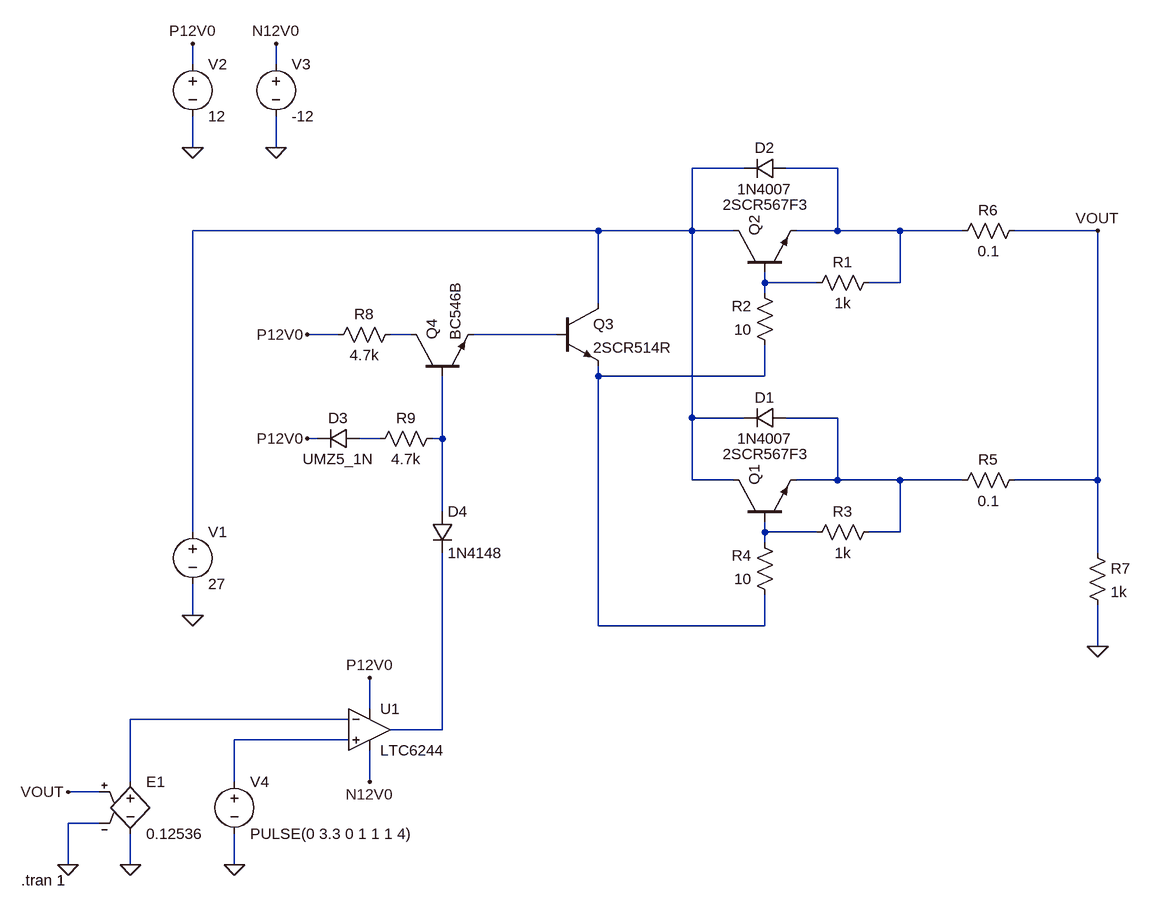
[diagram p0: schematic PowerBoard_PowerSection.asc]
PowerBoard_PowerSection.asc, the LTspice schematic file:
Version 4.1
SHEET 1 1464 728
WIRE 16 -544 16 -576
WIRE 144 -544 144 -576
WIRE 16 -416 16 -464
WIRE 144 -416 144 -464
WIRE 864 -384 784 -384
WIRE 1008 -384 928 -384
WIRE 640 -288 16 -288
WIRE 784 -288 784 -384
WIRE 784 -288 640 -288
WIRE 848 -288 784 -288
WIRE 1008 -288 1008 -384
WIRE 1008 -288 944 -288
WIRE 1104 -288 1008 -288
WIRE 1200 -288 1104 -288
WIRE 1408 -288 1280 -288
WIRE 896 -208 896 -224
WIRE 976 -208 896 -208
WIRE 1104 -208 1104 -288
WIRE 1104 -208 1056 -208
WIRE 896 -192 896 -208
WIRE 640 -176 640 -288
WIRE 240 -128 192 -128
WIRE 352 -128 320 -128
WIRE 576 -128 448 -128
WIRE 640 -64 640 -80
WIRE 896 -64 896 -112
WIRE 896 -64 640 -64
WIRE 784 0 784 -288
WIRE 864 0 784 0
WIRE 1008 0 928 0
WIRE 208 32 192 32
WIRE 304 32 272 32
WIRE 400 32 400 -64
WIRE 400 32 384 32
WIRE 784 96 784 0
WIRE 848 96 784 96
WIRE 1008 96 1008 0
WIRE 1008 96 944 96
WIRE 1104 96 1008 96
WIRE 1200 96 1104 96
WIRE 1408 96 1408 -288
WIRE 1408 96 1280 96
WIRE 400 144 400 32
WIRE 16 176 16 -288
WIRE 896 176 896 160
WIRE 976 176 896 176
WIRE 1104 176 1104 96
WIRE 1104 176 1056 176
WIRE 896 192 896 176
WIRE 1408 208 1408 96
WIRE 16 304 16 256
WIRE 640 320 640 -64
WIRE 896 320 896 272
WIRE 896 320 640 320
WIRE 1408 352 1408 288
WIRE 288 448 288 400
WIRE 256 464 -80 464
WIRE 400 480 400 208
WIRE 400 480 320 480
WIRE 256 496 80 496
WIRE -80 560 -80 464
WIRE 80 560 80 496
WIRE 288 560 288 512
WIRE -128 576 -176 576
WIRE -128 624 -176 624
WIRE -176 688 -176 624
WIRE -80 688 -80 640
WIRE 80 688 80 640
FLAG 16 304 0
FLAG 1408 352 0
FLAG 16 -416 0
FLAG 16 -576 P12V0
FLAG 144 -416 0
FLAG 144 -576 N12V0
FLAG 192 -128 P12V0
FLAG 192 32 P12V0
FLAG 288 400 P12V0
FLAG 288 560 N12V0
FLAG 80 688 0
FLAG -80 688 0
FLAG -176 688 0
FLAG -176 576 VOUT
FLAG 1408 -288 VOUT
SYMBOL voltage 16 160 R0
WINDOW 123 0 0 Left 0
WINDOW 39 0 0 Left 0
SYMATTR InstName V1
SYMATTR Value 27
SYMBOL npn 848 160 R270
WINDOW 3 104 -17 VRight 2
SYMATTR InstName Q1
SYMATTR Value 2SCR567F3
SYMBOL res 1072 160 R90
WINDOW 0 0 56 VBottom 2
WINDOW 3 32 56 VTop 2
SYMATTR InstName R3
SYMATTR Value 1k
SYMBOL res 912 288 R180
WINDOW 0 36 76 Left 2
WINDOW 3 36 40 Left 2
SYMATTR InstName R4
SYMATTR Value 10
SYMBOL diode 928 -16 R90
WINDOW 0 0 32 VBottom 2
WINDOW 3 32 32 VTop 2
SYMATTR InstName D1
SYMATTR Value 1N4007
SYMBOL res 1296 80 R90
WINDOW 0 0 56 VBottom 2
WINDOW 3 32 56 VTop 2
SYMATTR InstName R5
SYMATTR Value 0.1
SYMBOL npn 848 -224 R270
WINDOW 3 104 -17 VRight 2
SYMATTR InstName Q2
SYMATTR Value 2SCR567F3
SYMBOL res 1072 -224 R90
WINDOW 0 0 56 VBottom 2
WINDOW 3 32 56 VTop 2
SYMATTR InstName R1
SYMATTR Value 1k
SYMBOL res 912 -96 R180
WINDOW 0 36 76 Left 2
WINDOW 3 36 40 Left 2
SYMATTR InstName R2
SYMATTR Value 10
SYMBOL diode 928 -400 R90
WINDOW 0 0 32 VBottom 2
WINDOW 3 32 32 VTop 2
SYMATTR InstName D2
SYMATTR Value 1N4007
SYMBOL res 1296 -304 R90
WINDOW 0 0 56 VBottom 2
WINDOW 3 32 56 VTop 2
SYMATTR InstName R6
SYMATTR Value 0.1
SYMBOL res 1392 192 R0
SYMATTR InstName R7
SYMATTR Value 1k
SYMBOL npn 576 -176 R0
SYMATTR InstName Q3
SYMATTR Value 2SCR514R
SYMBOL voltage 16 -560 R0
WINDOW 123 0 0 Left 0
WINDOW 39 0 0 Left 0
SYMATTR InstName V2
SYMATTR Value 12
SYMBOL voltage 144 -560 R0
WINDOW 123 0 0 Left 0
WINDOW 39 0 0 Left 0
SYMATTR InstName V3
SYMATTR Value -12
SYMBOL npn 352 -64 R270
SYMATTR InstName Q4
SYMATTR Value BC546B
SYMBOL res 336 -144 R90
WINDOW 0 0 56 VBottom 2
WINDOW 3 32 56 VTop 2
SYMATTR InstName R8
SYMATTR Value 4.7k
SYMBOL res 400 16 R90
WINDOW 0 0 56 VBottom 2
WINDOW 3 32 56 VTop 2
SYMATTR InstName R9
SYMATTR Value 4.7k
SYMBOL diode 272 16 R90
WINDOW 0 0 32 VBottom 2
WINDOW 3 32 32 VTop 2
SYMATTR InstName D3
SYMATTR Value UMZ5_1N
SYMATTR Description Diode
SYMATTR Type diode
SYMBOL diode 384 144 R0
SYMATTR InstName D4
SYMATTR Value 1N4148
SYMBOL OpAmps\\LTC6244 288 480 R0
SYMATTR InstName U1
SYMBOL voltage 80 544 R0
WINDOW 123 0 0 Left 0
WINDOW 39 0 0 Left 0
SYMATTR InstName V4
SYMATTR Value PULSE(0 3.3 0 1 1 1 4)
SYMBOL e -80 544 R0
SYMATTR InstName E1
SYMATTR Value 0.12536
TEXT -248 712 Left 2 !.tran 1

The netlist it stands for:
* PowerBoard_PowerSection.asc
V1 N001 0 27
Q1 N001 N010 N007 0 2SCR567F3
R3 N007 N010 1k
R4 N006 N010 10
D1 N007 N001 1N4007
R5 VOUT N007 0.1
Q2 N001 N003 N002 0 2SCR567F3
R1 N002 N003 1k
R2 N006 N003 10
D2 N002 N001 1N4007
R6 VOUT N002 0.1
R7 VOUT 0 1k
Q3 N001 N005 N006 0 2SCR514R
V2 P12V0 0 12
V3 N12V0 0 -12
Q4 N004 N009 N005 0 BC546B
R8 N004 P12V0 4.7k
R9 N009 N008 4.7k
D3 N008 P12V0 UMZ5_1N
D4 N009 N012 1N4148
X§U1 N013 N011 P12V0 N12V0 N012 LTC6244  ; pins In+ In- V+ V- OUT
V4 N013 0 PULSE(0 3.3 0 1 1 1 4)
E1 N011 0 VOUT 0 0.12536
.model D D
.lib standard.dio
.model NPN NPN
.model PNP PNP
.lib standard.bjt
.tran 1
.backanno
.end